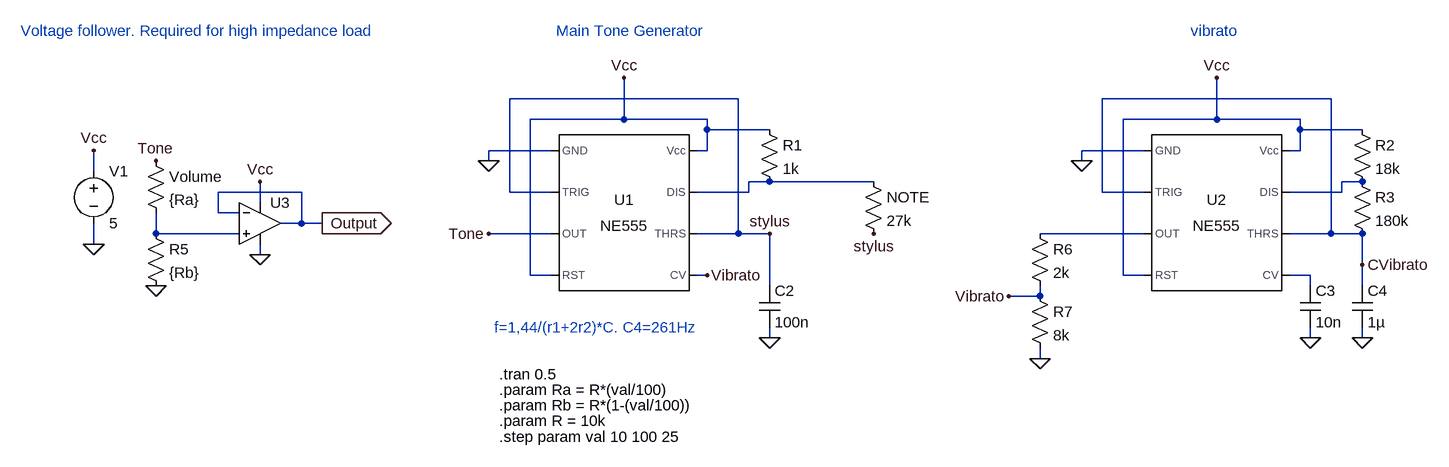
[diagram p0: schematic stylophonev01.asc]
stylophonev01.asc, the LTspice schematic file:
Version 4.1
SHEET 1 1460 788
WIRE 336 -16 -16 -16
WIRE 1248 -16 896 -16
WIRE 160 16 160 -48
WIRE 160 16 16 16
WIRE 288 16 160 16
WIRE 1072 16 1072 -48
WIRE 1072 16 928 16
WIRE 1200 16 1072 16
WIRE 288 32 288 16
WIRE 384 32 288 32
WIRE 1200 32 1200 16
WIRE 1296 32 1200 32
WIRE 48 64 -48 64
WIRE 288 64 288 32
WIRE 288 64 272 64
WIRE 960 64 864 64
WIRE 1200 64 1200 32
WIRE 1200 64 1184 64
WIRE -48 80 -48 64
WIRE 864 80 864 64
WIRE -656 96 -656 64
WIRE 384 112 352 112
WIRE 544 112 384 112
WIRE 1296 112 1264 112
WIRE -336 128 -464 128
WIRE -16 128 -16 -16
WIRE 48 128 -16 128
WIRE 352 128 352 112
WIRE 352 128 272 128
WIRE 896 128 896 -16
WIRE 960 128 896 128
WIRE 1264 128 1264 112
WIRE 1264 128 1184 128
WIRE -400 144 -400 112
WIRE -464 160 -464 128
WIRE -432 160 -464 160
WIRE -336 176 -336 128
WIRE -336 176 -368 176
WIRE -304 176 -336 176
WIRE -560 192 -560 160
WIRE -432 192 -560 192
WIRE 48 192 -48 192
WIRE 336 192 336 -16
WIRE 336 192 272 192
WIRE 384 192 336 192
WIRE 960 192 800 192
WIRE 1248 192 1248 -16
WIRE 1248 192 1184 192
WIRE 1296 192 1248 192
WIRE -656 208 -656 176
WIRE -400 224 -400 208
WIRE 1296 240 1296 192
WIRE 16 256 16 16
WIRE 48 256 16 256
WIRE 288 256 272 256
WIRE 928 256 928 16
WIRE 960 256 928 256
WIRE 1216 256 1184 256
WIRE 384 272 384 192
WIRE 1216 272 1216 256
WIRE 1296 272 1296 240
WIRE 800 288 800 272
WIRE 800 288 752 288
WIRE 384 352 384 336
WIRE 1216 352 1216 336
WIRE 1296 352 1296 336
WIRE 800 384 800 368
FLAG 384 352 0
FLAG 160 -48 Vcc
FLAG -48 80 0
FLAG 384 192 stylus
FLAG 544 192 stylus
FLAG 1216 352 0
FLAG 1296 352 0
FLAG 1072 -48 Vcc
FLAG 864 80 0
FLAG 288 256 Vibrato
FLAG -400 224 0
FLAG -400 112 Vcc
FLAG -560 80 Tone
FLAG -48 192 Tone
FLAG -656 208 0
FLAG -656 64 Vcc
FLAG -560 272 0
FLAG 1296 240 CVibrato
FLAG -304 176 Output
IOPIN -304 176 Out
FLAG 800 384 0
FLAG 752 288 Vibrato
SYMBOL Misc\\NE555 160 160 R0
SYMATTR InstName U1
SYMBOL cap 368 272 R0
SYMATTR InstName C2
SYMATTR Value 100n
SYMBOL res 528 96 R0
SYMATTR InstName NOTE
SYMATTR Value 27k
SYMBOL res 368 16 R0
SYMATTR InstName R1
SYMATTR Value 1k
SYMBOL Misc\\NE555 1072 160 R0
SYMATTR InstName U2
SYMBOL cap 1200 272 R0
SYMATTR InstName C3
SYMATTR Value 10n
SYMBOL cap 1280 272 R0
SYMATTR InstName C4
SYMATTR Value 1µ
SYMBOL res 1280 16 R0
SYMATTR InstName R2
SYMATTR Value 18k
SYMBOL res 1280 96 R0
SYMATTR InstName R3
SYMATTR Value 180k
SYMBOL OpAmps\\UniversalOpAmp1 -400 176 R0
SYMATTR InstName U3
SYMBOL res -576 64 R0
SYMATTR InstName Volume
SYMATTR Value {Ra}
SYMBOL voltage -656 80 R0
WINDOW 123 0 0 Left 0
WINDOW 39 0 0 Left 0
SYMATTR InstName V1
SYMATTR Value 5
SYMBOL res -576 176 R0
SYMATTR InstName R5
SYMATTR Value {Rb}
SYMBOL res 784 176 R0
SYMATTR InstName R6
SYMATTR Value 2k
SYMBOL res 784 272 R0
SYMATTR InstName R7
SYMATTR Value 8k
TEXT -32 408 Left 2 !.tran 0.5
TEXT -40 336 Left 2 ;f=1,44/(r1+2r2)*C. C4=261Hz
TEXT 1032 -120 Left 2 ;vibrato
TEXT 56 -120 Left 2 ;Main Tone Generator
TEXT -768 -120 Left 2 ;Voltage follower. Required for high impedance load
TEXT -32 432 Left 2 !.param Ra = R*(val/100)
TEXT -32 456 Left 2 !.param Rb = R*(1-(val/100))
TEXT -32 480 Left 2 !.param R = 10k
TEXT -32 504 Left 2 !.step param val 10 100 25

The netlist it stands for:
* stylophonev01.asc
X§U1 0 stylus Tone Vcc Vibrato stylus N001 Vcc NE555  ; pins GND TRIG OUT RST CV THRS DIS Vcc
C2 stylus 0 100n
R§NOTE N001 stylus 27k
R1 Vcc N001 1k
X§U2 0 CVibrato N004 Vcc N005 CVibrato N002 Vcc NE555  ; pins GND TRIG OUT RST CV THRS DIS Vcc
C3 N005 0 10n
C4 CVibrato 0 1µ
R2 Vcc N002 18k
R3 N002 CVibrato 180k
X§U3 N003 Output Vcc 0 Output level1 Avol=1Meg GBW=10Meg Vos=0 En=0 Enk=0 In=0 Ink=0 Rin=500Meg  ; pins In+ In- V+ V- OUT
R§Volume Tone N003 {Ra}
V1 Vcc 0 5
R5 N003 0 {Rb}
R6 N004 Vibrato 2k
R7 Vibrato 0 8k
.tran 0.5
* f=1,44/(r1+2r2)*C. C4=261Hz
* vibrato
* Main Tone Generator
* Voltage follower. Required for high impedance load
.param Ra = R*(val/100)
.param Rb = R*(1-(val/100))
.param R = 10k
.step param val 10 100 25
.lib NE555.sub
.lib UniversalOpAmp1.lib
.backanno
.end